# Altium schematic sheet Sen_PF.SchDoc
size A4
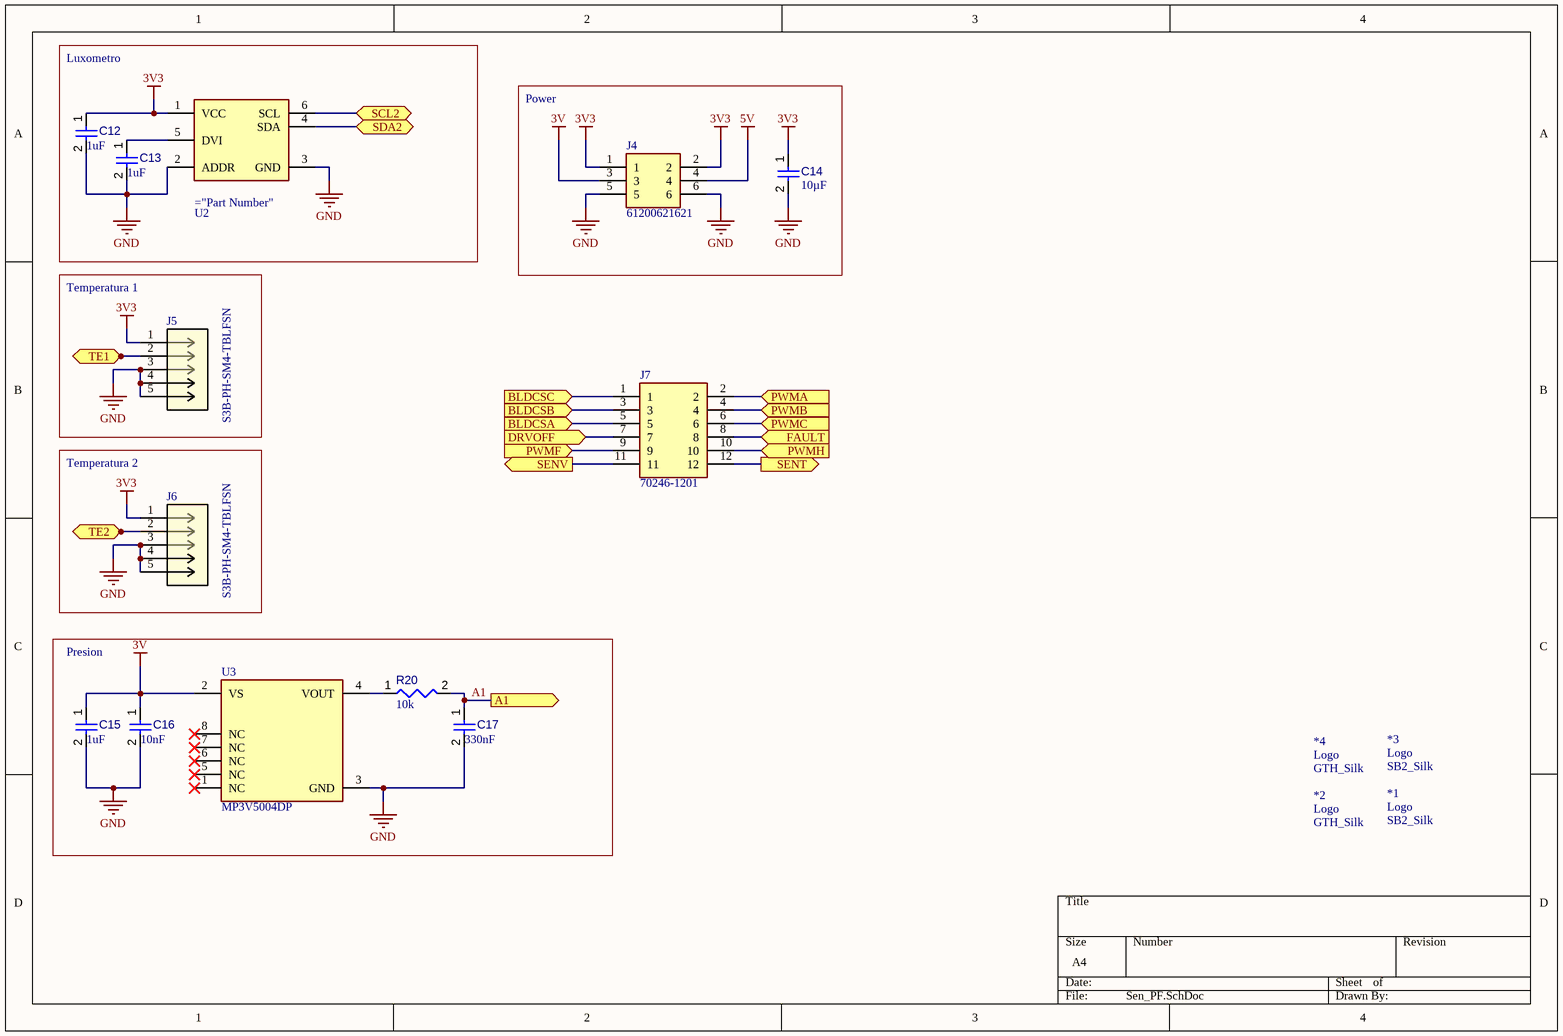
[diagram p0: Sen_PF.SchDoc]

## Parts
*1  SB2_Silk  [SMARTBEDDING2_SILK]
*2  GTH_Silk  [TECHHUB_SILK]
*3  SB2_Silk  [SMARTBEDDING2_SILK]
*4  GTH_Silk  [TECHHUB_SILK]
C12  value 1uF  [CAPC1608X90X40NL10T20]  (hidden comment: Capacitor 100 nF +/-10% 50 V 0603)
C13  value 1uF  [CAPC1608X90X40NL10T20]  (hidden comment: Capacitor 100 nF +/-10% 50 V 0603)
C14  value 10µF  [CAPC0805(2012)145_L]  (hidden comment: Capacitor 22µF +/-40% 16V 0805)
C15  value 1uF  [CAPC1608X90X40NL10T20]  (hidden comment: Capacitor 100 nF +/-10% 50 V 0603)
C16  value 10nF  [CAPC1608X90X40NL10T20]  (hidden comment: Capacitor 100 nF +/-10% 50 V 0603)
C17  value 330nF  [CAPC1608X90X40NL10T20]  (hidden comment: Capacitor 100 nF +/-10% 50 V 0603)
J4  61200621621  [SHDR6W64P254_2X3_1528X910X910P]
J5  S3B-PH-SM4-TBLFSN  [CONN_S3B-PH-SM4-TBLFSN_JST]
J6  S3B-PH-SM4-TBLFSN  [CONN_S3B-PH-SM4-TBLFSN_JST]
J7  70246-1201  [SHDR12W99P254_2X6_2286X889X927P]
R20  value 10k  [RESC1608X55X25ML10T15]  (hidden comment: Resistor 10k +/-1% 0603 100 mW)
U2  BH1750FVI-TR  [ROHM_BH1750FVI-TR_0]  (value not drawn)
U3  MP3V5004DP  [Freescale_Semiconductor_SOT1693-1_MFG]

## Blocks framed on the sheet
Luxometro: C12 C13 U2
Power: C14 J4
Temperatura 1: J5
Temperatura 2: J6
Presion: C15-C17 R20 U3

## Ports
A1 (out), BLDCSA (in), BLDCSB (in), BLDCSC (in), DRVOFF (in), FAULT (in), PWMA (in), PWMB (in), PWMC (in), PWMF (in), PWMH (in), SCL2 (bidir), SDA2 (bidir), SENT (out), SENV (out), TE1 (bidir), TE2 (bidir)

## Nets
3V: C15.1 C16.1 J4.3 U3.2(VS)
3V3: C12.1 C14.1 J4.1 J4.2 J5.1 J6.1 U2.1(VCC)
5V: J4.4
GND: C12.2 C13.2 C14.2 C15.2 C16.2 C17.2 J4.5 J4.6 J5.3 J5.4 J5.5 J6.3 J6.4 J6.5 U2.2(ADDR) U2.3(GND) U3.3(GND)
A1: C17.1 R20.2 ; port A1
BLDCSA: J7.5 ; port BLDCSA
BLDCSB: J7.3 ; port BLDCSB
BLDCSC: J7.1 ; port BLDCSC
DRVOFF: J7.7 ; port DRVOFF
FAULT: J7.8 ; port FAULT
PWMA: J7.2 ; port PWMA
PWMB: J7.4 ; port PWMB
PWMC: J7.6 ; port PWMC
PWMF: J7.9 ; port PWMF
PWMH: J7.10 ; port PWMH
SCL2: U2.6(SCL) ; port SCL2
SDA2: U2.4(SDA) ; port SDA2
SENT: J7.12 ; port SENT
SENV: J7.11 ; port SENV
TE1: J5.2 ; port TE1
TE2: J6.2 ; port TE2
NetC13_1: C13.1 U2.5(DVI)
NetR20_1: R20.1 U3.4(VOUT)

Not connected (* = marked no-connect by the designer): U3 1(NC)* 5(NC)* 6(NC)* 7(NC)* 8(NC)*

## Notes on the sheet
- (in symbol GTH_Silk) Logo
- (in symbol SB2_Silk) Logo

## Library data of the parts
C12 C13 C15-C17 = CMP-001-00017-6: Chip Capacitor, 100 nF, +/- 10%, 50 V, 0603 (1608 Metric); Capacitor Type: Ceramic; Voltage Rating: 50V; Max Operating Temperature: 125°C; Min Operating Temperature: -55°C; Case/Package: 0603; Mounting Technology: SM; Pins: 2; Tolerance: 10%; RoHS Compliant: True
C14 = CMP-001-00081-4: Chip Capacitor, 22µF +/-40%, 16V, 0805, Thickness 1.45 mm; Tolerance: 5%; Voltage Rating: 16V; Mounting Technology: SMT; Pins: 2; Max Operating Temperature: 85°C; Case/Package: 0805; Min Operating Temperature: -55°C
J4 = 61200621621: Wurth Elektronik PCB Header WR-BHD, 6 Way, 2.54mm Pitch, 2 Row, Straight, Through Hole; Geometry.Height: 9.1mm; Manufacturer_Name: Wurth Elektronik; Manufacturer_Part_Number: 61200621621; Mouser Part Number: 710-61200621621; Mouser Price/Stock: https://www.mouser.co.uk/ProductDetail/Wurth-Elektronik/61200621621?qs=PhR8RmCirEbjX8n1RKw4Jw%3D%3D; Arrow Part Number: *; Arrow Price/Stock: *; Datasheet Link: https://katalog.we-online.de/em/datasheet/6120xx21621.pdf
J5 J6 = S3B-PH-SM4-TBLFSN: No Description Available; Mfr_Name: JST; RefDes: RefDes; Type: Type
J7 = 70246-1201: MOLEX - 70246-1201 - Wire-To-Board Connector, 2.54 mm, 12 Contacts, Header, C-Grid 70246 Series, Through Hole, 2 Rows; Geometry.Height: 9.27mm; Manufacturer_Name: Molex; Manufacturer_Part_Number: 70246-1201; Mouser Part Number: 538-70246-1201; Mouser Price/Stock: https://www.mouser.co.uk/ProductDetail/Molex/70246-1201?qs=fJMuCzod2IK5EwAAa91t%252Bg%3D%3D; Arrow Part Number: *; Arrow Price/Stock: *; Datasheet Link: https://datasheet.datasheetarchive.com/originals/distributors/Datasheets-DGA22/2151895.pdf
R20 = CMP-009-00017-5: Chip Resistor, 10 KOhm, +/- 1%, 01 W, -55 to 155 degC, 0603 (1608 Metric); Voltage Rating: 50V; Power: 100mW; RoHS Compliant: True; Min Operating Temperature: -55°C; Pins: 2; Case/Package: 0603; Mounting Technology: SM; Max Operating Temperature: 155°C; Tolerance: 1%
U2 = BH1750FVI-TR: BH1730FVI-TR
U3 = CMP-005-000000-1: Pressure Sensor 0.57PSI (3.92kPa) Differential Male - 0.13" (3.3mm) Tube, Dual 0.6 V ~ 3 V 8-BSOP (0.475", 12.06mm Width) Dual Ports, Same Side; Manufacturer: Freescale Semiconductor; Operating Supply Current: 10mA; Max Supply Voltage: 3.3V; Sensor Output: Analog Voltage; Port Style: Barbed; Standoff Height: 0.002inch; Min Supply Voltage: 2.7V; Symbol Hash: 4bc8a08c37d40424599bb33cee3b30e359dd3ad4e50bf560f40db3af4523a191; Accuracy: 1.5%; Output Voltage: 3V; Device Class L3: unset; Lead Free: Yes; Mouser Description: Board Mount Pressure / Force Sensors SOP W/DUAL PORT 3V; Digikey Part Number: MP3V5004DP-ND; Ambient Temperature Range High: +85°C; Ipc Land Pattern Name: SOP254P1753X965-8; ComponentLink1Description: Upverter; Digikey Description: IC PRESSURE SENSOR 8-SOP; Device Class L2: Pressure Sensors; Category: IC; ComponentLink1URL: https://upverter.com/part/id/b53385bc3ba3d6ea/; Temperature Range High: 85°C; Part Number: MP3V5004DP; Mouser Part Number: 841-MP3V5004DP; Automotive: No; Footprint Url: https://www.nxp.com/docs/en/package-information/98ASA99255D.pdf; Datasheet Path: datasheets/IC_Freescale_Semiconductor_MP3V5004DP_eec.pdf; ComponentLink2Description: Datasheet; RoHS: TRUE; Device Class L1: Sensors; Height: 0.39inch; ComponentLink2URL: https://www.nxp.com/docs/en/data-sheet/MP3V5004G.pdf; Package: SOT1693-1; helpURL: https://upverter.com/part/id/b53385bc3ba3d6ea/; Temperature: 0°C to +85°C; Temperature Range Low: 0°C; Ambient Temperature Range Low: 0°C